# EasyEDA Pro project ProDoc_Custom Keyboard_2025-10-23_RV1.eprj, schematic Custom Keyboard

## Sheets
1 MCU: Board Name: Custom Keyboard; Create Date: 2025-08-29; Page Name: MCU; Project Name: Custom Keyboard; Schematic Name: Custom Keyboard; Update Date: 2025-09-15; Company: (C) FEDEVEL 2025; Drawn: Robert Feranec; Page Size: A3; Part Number: JLCPCB-002; Reviewed: EasyEDA; Version: V1.0
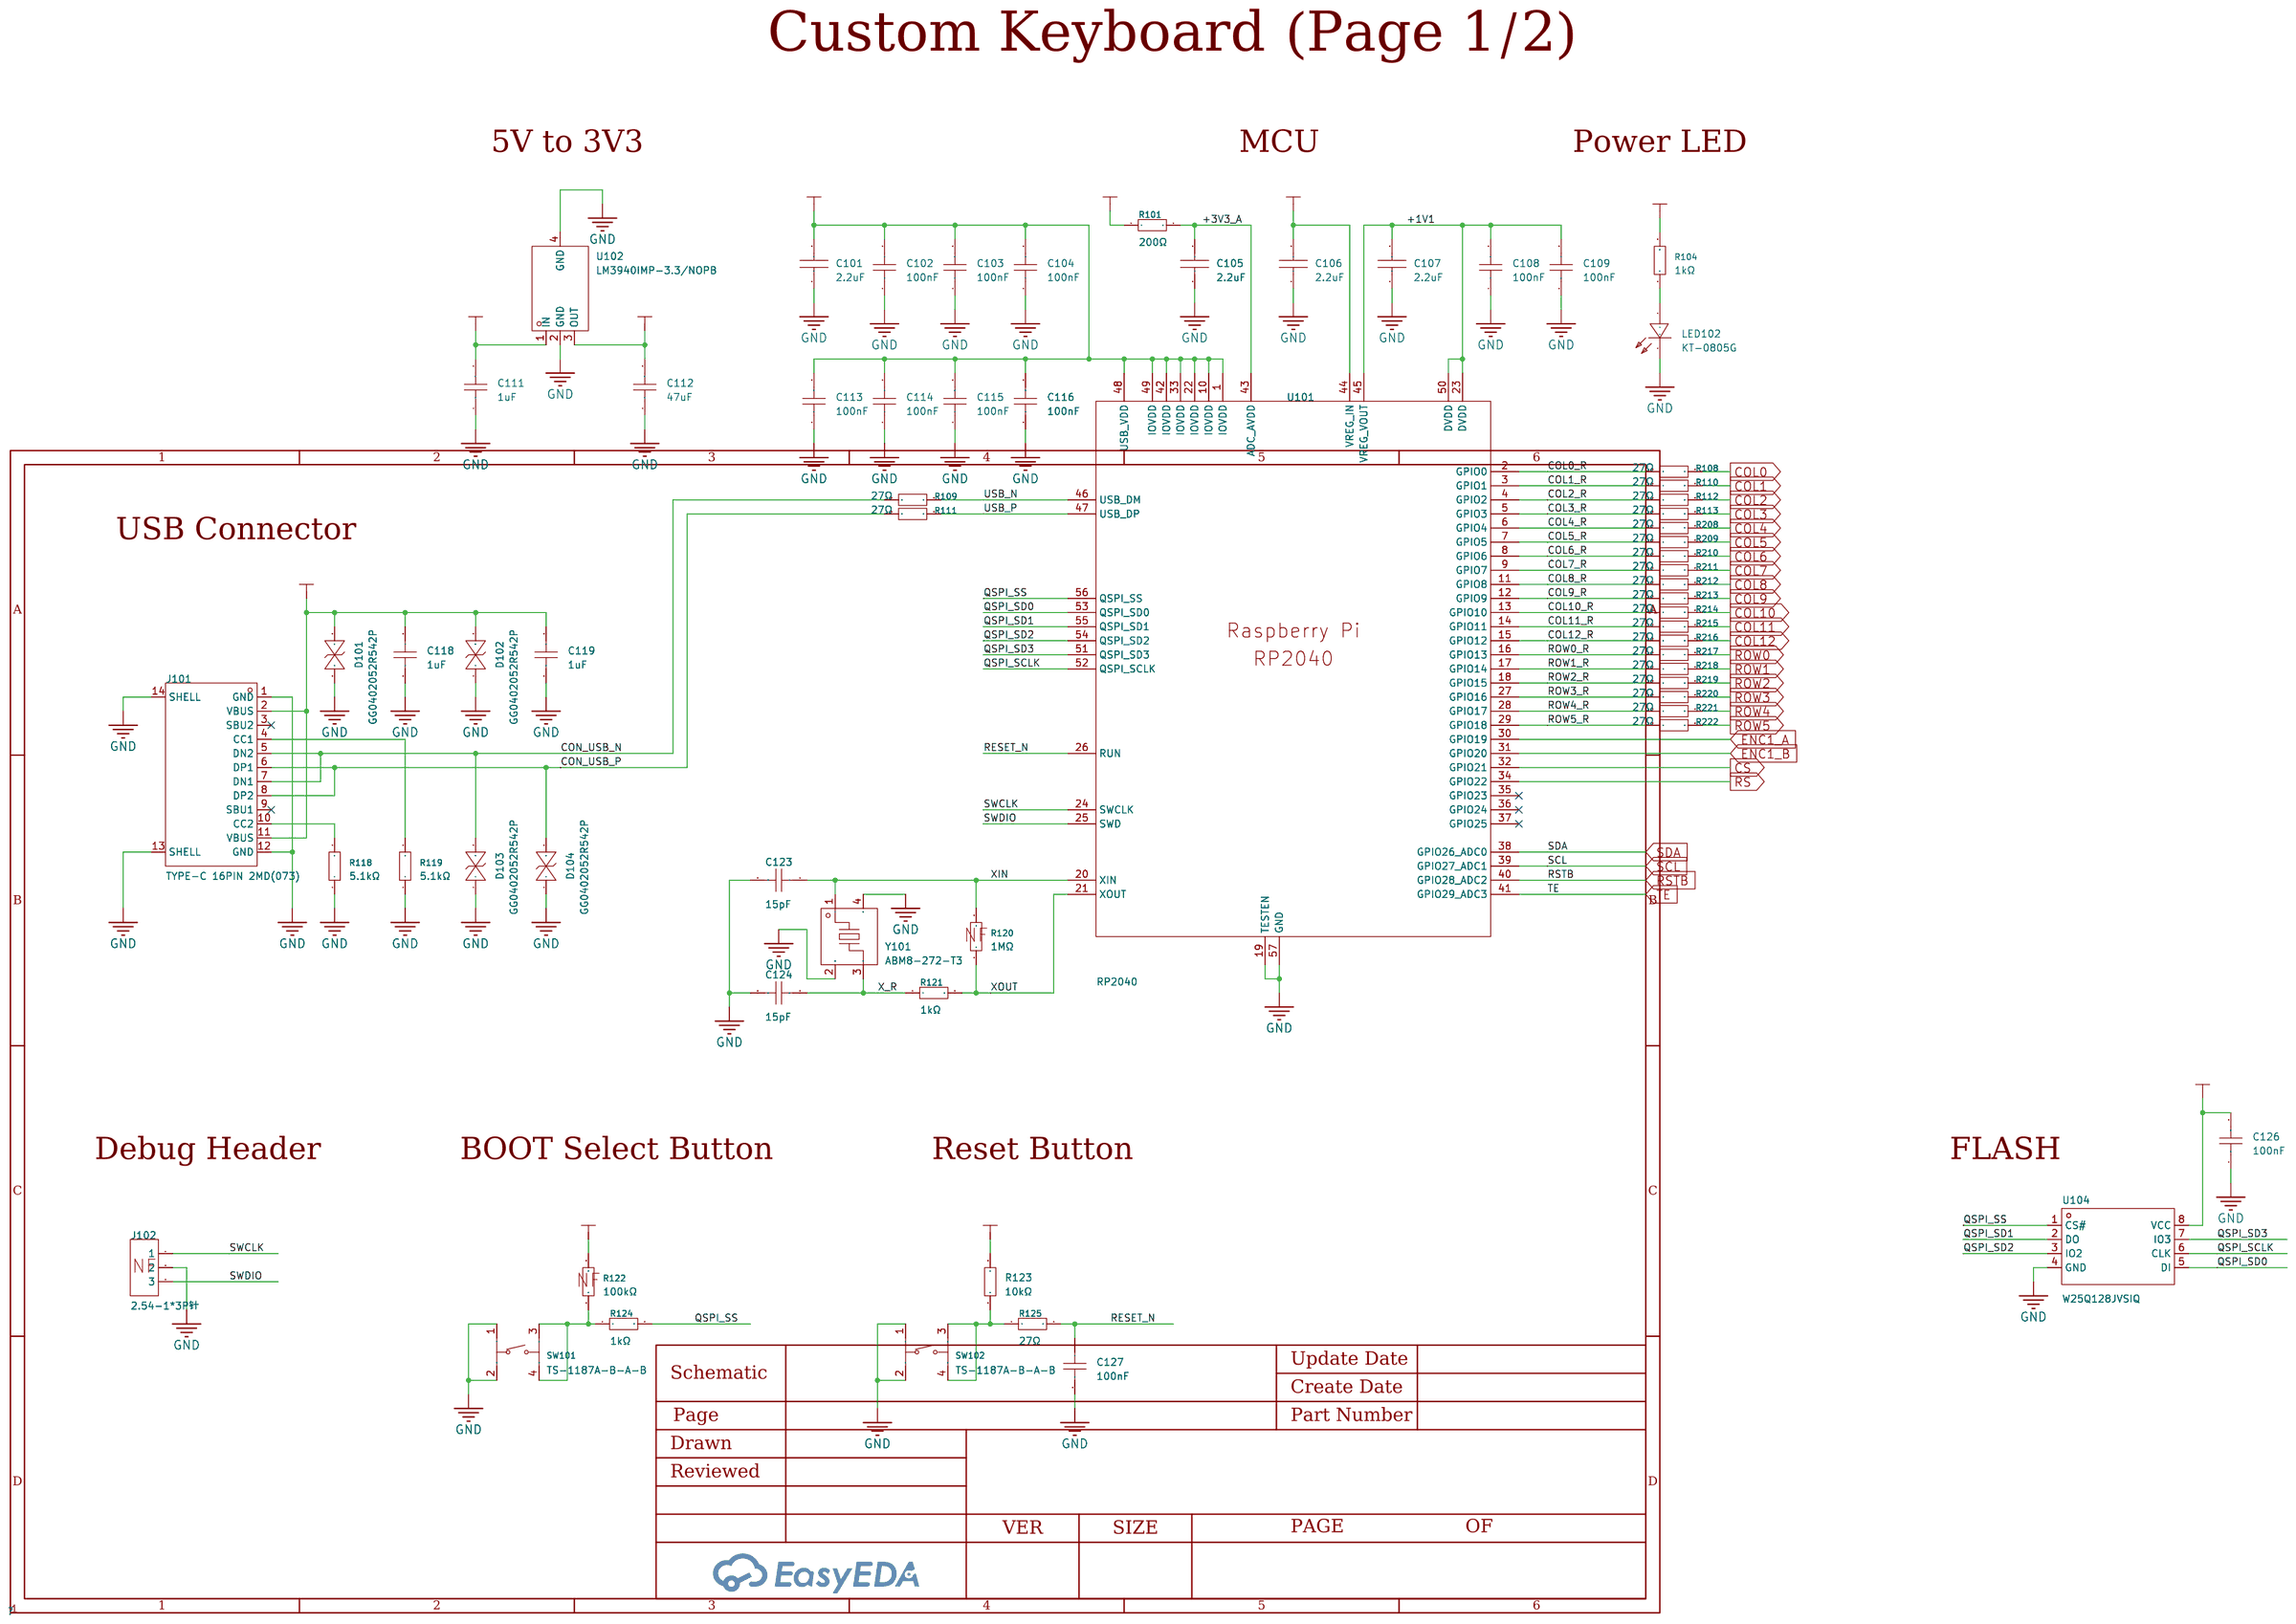
[diagram p0: MCU]
2 OTHER: Page Name: OTHER
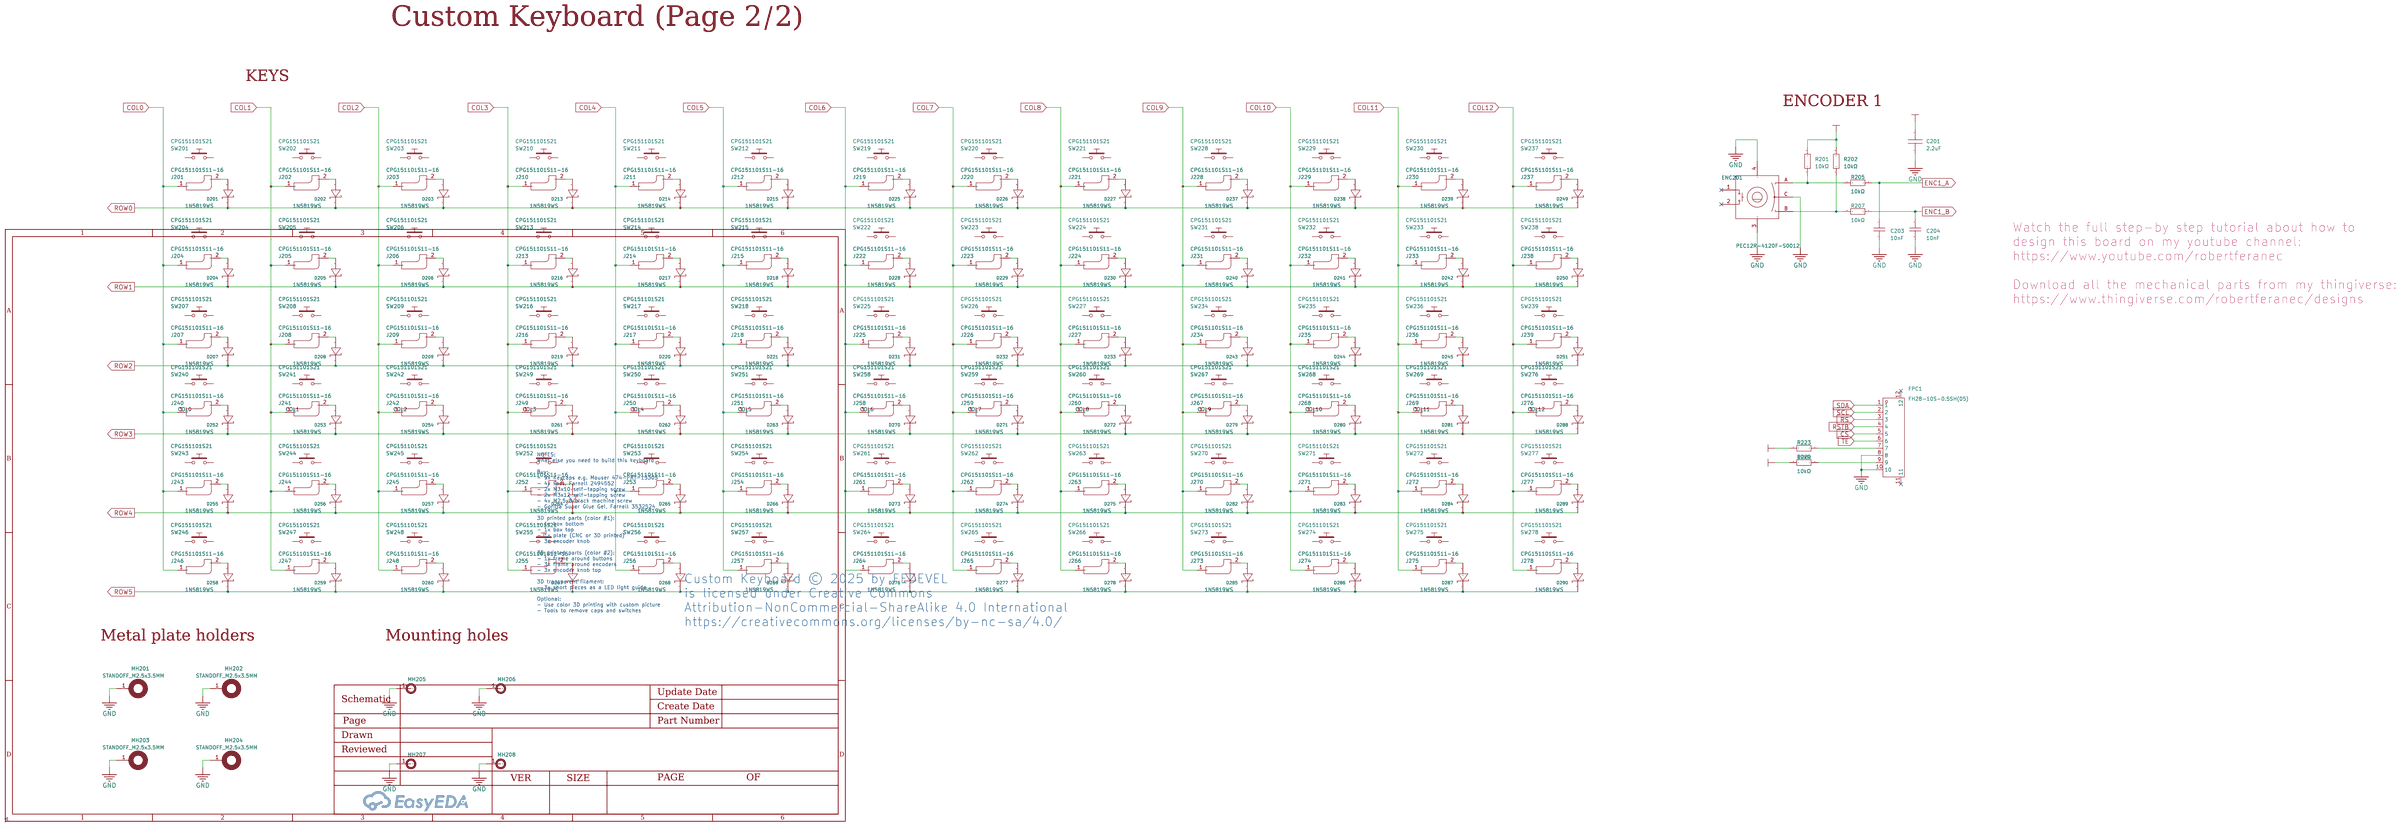
[diagram p1: OTHER]

## Parts
sheet MCU
C101  2.2uF  [C0402]
C102  100nF  [C0402]
C103  100nF  [C0402]
C104  100nF  [C0402]
C105  2.2uF  [C0402]
C106  2.2uF  [C0402]
C107  2.2uF  [C0402]
C108  100nF  [C0402]
C109  100nF  [C0402]
C111  1uF  [C0402]
C112  47uF  [C1206]
C113  100nF  [C0402]
C114  100nF  [C0402]
C115  100nF  [C0402]
C116  100nF  [C0402]
C118  1uF  [C0402]
C119  1uF  [C0402]
C123  15pF  [C0402]
C124  15pF  [C0402]
C126  100nF  [C0402]
C127  100nF  [C0402]
D101  GG0402052R542P  [D0402-BI]
D102  GG0402052R542P  [D0402-BI]
D103  GG0402052R542P  [D0402-BI]
D104  GG0402052R542P  [D0402-BI]
J101  TYPE-C 16PIN 2MD(073)  [USB-C-SMD_TYPE-C-6PIN-2MD-073]
J102  2.54-1*3P针  [HDR-TH_3P-P2.54-V-M-1]  (no BOM)
LED102  KT-0805G  [LED0805-R-RD]
R101  200Ω  [R0402]
R104  1kΩ  [R0402]
R108  27Ω  [R0402]
R109  27Ω  [R0402]
R110  27Ω  [R0402]
R111  27Ω  [R0402]
R112  27Ω  [R0402]
R113  27Ω  [R0402]
R118  5.1kΩ  [R0402]
R119  5.1kΩ  [R0402]
R120  1MΩ  [R0402]  (no BOM)
R121  1kΩ  [R0402]
R122  100kΩ  [R0402]  (no BOM)
R123  10kΩ  [R0402]
R124  1kΩ  [R0402]
R125  27Ω  [R0402]
R208  27Ω  [R0402]
R209  27Ω  [R0402]
R210  27Ω  [R0402]
R211  27Ω  [R0402]
R212  27Ω  [R0402]
R213  27Ω  [R0402]
R214  27Ω  [R0402]
R215  27Ω  [R0402]
R216  27Ω  [R0402]
R217  27Ω  [R0402]
R218  27Ω  [R0402]
R219  27Ω  [R0402]
R220  27Ω  [R0402]
R221  27Ω  [R0402]
R222  27Ω  [R0402]
SW101  TS-1187A-B-A-B  [SW-SMD_4P-L5.1-W5.1-P3.70-LS6.5-TL-2]
SW102  TS-1187A-B-A-B  [SW-SMD_4P-L5.1-W5.1-P3.70-LS6.5-TL-2]
U101  RP2040  [LQFN-56_L7.0-W7.0-P0.4-EP_1]
U102  LM3940IMP-3.3/NOPB  [SOT-223_L6.5-W3.5-P2.30-LS7.0-BR]
U104  W25Q128JVSIQ  [SOIC-8_L5.3-W5.3-P1.27-LS8.0-BL]
Y101  ABM8-272-T3  [CRYSTAL-SMD_4P-L3.2-W2.5-BL]
sheet OTHER
C201  2.2uF  [C0402]
C203  10nF  [C0402]
C204  10nF  [C0402]
D201  1N5819WS  [SOD-323_L1.8-W1.3-LS2.5-RD]
D202  1N5819WS  [SOD-323_L1.8-W1.3-LS2.5-RD]
D203  1N5819WS  [SOD-323_L1.8-W1.3-LS2.5-RD]
D204  1N5819WS  [SOD-323_L1.8-W1.3-LS2.5-RD]
D205  1N5819WS  [SOD-323_L1.8-W1.3-LS2.5-RD]
D206  1N5819WS  [SOD-323_L1.8-W1.3-LS2.5-RD]
D207  1N5819WS  [SOD-323_L1.8-W1.3-LS2.5-RD]
D208  1N5819WS  [SOD-323_L1.8-W1.3-LS2.5-RD]
D209  1N5819WS  [SOD-323_L1.8-W1.3-LS2.5-RD]
D213  1N5819WS  [SOD-323_L1.8-W1.3-LS2.5-RD]
D214  1N5819WS  [SOD-323_L1.8-W1.3-LS2.5-RD]
D215  1N5819WS  [SOD-323_L1.8-W1.3-LS2.5-RD]
D216  1N5819WS  [SOD-323_L1.8-W1.3-LS2.5-RD]
D217  1N5819WS  [SOD-323_L1.8-W1.3-LS2.5-RD]
D218  1N5819WS  [SOD-323_L1.8-W1.3-LS2.5-RD]
D219  1N5819WS  [SOD-323_L1.8-W1.3-LS2.5-RD]
D220  1N5819WS  [SOD-323_L1.8-W1.3-LS2.5-RD]
D221  1N5819WS  [SOD-323_L1.8-W1.3-LS2.5-RD]
D225  1N5819WS  [SOD-323_L1.8-W1.3-LS2.5-RD]
D226  1N5819WS  [SOD-323_L1.8-W1.3-LS2.5-RD]
D227  1N5819WS  [SOD-323_L1.8-W1.3-LS2.5-RD]
D228  1N5819WS  [SOD-323_L1.8-W1.3-LS2.5-RD]
D229  1N5819WS  [SOD-323_L1.8-W1.3-LS2.5-RD]
D230  1N5819WS  [SOD-323_L1.8-W1.3-LS2.5-RD]
D231  1N5819WS  [SOD-323_L1.8-W1.3-LS2.5-RD]
D232  1N5819WS  [SOD-323_L1.8-W1.3-LS2.5-RD]
D233  1N5819WS  [SOD-323_L1.8-W1.3-LS2.5-RD]
D237  1N5819WS  [SOD-323_L1.8-W1.3-LS2.5-RD]
D238  1N5819WS  [SOD-323_L1.8-W1.3-LS2.5-RD]
D239  1N5819WS  [SOD-323_L1.8-W1.3-LS2.5-RD]
D240  1N5819WS  [SOD-323_L1.8-W1.3-LS2.5-RD]
D241  1N5819WS  [SOD-323_L1.8-W1.3-LS2.5-RD]
D242  1N5819WS  [SOD-323_L1.8-W1.3-LS2.5-RD]
D243  1N5819WS  [SOD-323_L1.8-W1.3-LS2.5-RD]
D244  1N5819WS  [SOD-323_L1.8-W1.3-LS2.5-RD]
D245  1N5819WS  [SOD-323_L1.8-W1.3-LS2.5-RD]
D249  1N5819WS  [SOD-323_L1.8-W1.3-LS2.5-RD]
D250  1N5819WS  [SOD-323_L1.8-W1.3-LS2.5-RD]
D251  1N5819WS  [SOD-323_L1.8-W1.3-LS2.5-RD]
D252  1N5819WS  [SOD-323_L1.8-W1.3-LS2.5-RD]
D253  1N5819WS  [SOD-323_L1.8-W1.3-LS2.5-RD]
D254  1N5819WS  [SOD-323_L1.8-W1.3-LS2.5-RD]
D255  1N5819WS  [SOD-323_L1.8-W1.3-LS2.5-RD]
D256  1N5819WS  [SOD-323_L1.8-W1.3-LS2.5-RD]
D257  1N5819WS  [SOD-323_L1.8-W1.3-LS2.5-RD]
D258  1N5819WS  [SOD-323_L1.8-W1.3-LS2.5-RD]
D259  1N5819WS  [SOD-323_L1.8-W1.3-LS2.5-RD]
D260  1N5819WS  [SOD-323_L1.8-W1.3-LS2.5-RD]
D261  1N5819WS  [SOD-323_L1.8-W1.3-LS2.5-RD]
D262  1N5819WS  [SOD-323_L1.8-W1.3-LS2.5-RD]
D263  1N5819WS  [SOD-323_L1.8-W1.3-LS2.5-RD]
D264  1N5819WS  [SOD-323_L1.8-W1.3-LS2.5-RD]
D265  1N5819WS  [SOD-323_L1.8-W1.3-LS2.5-RD]
D266  1N5819WS  [SOD-323_L1.8-W1.3-LS2.5-RD]
D267  1N5819WS  [SOD-323_L1.8-W1.3-LS2.5-RD]
D268  1N5819WS  [SOD-323_L1.8-W1.3-LS2.5-RD]
D269  1N5819WS  [SOD-323_L1.8-W1.3-LS2.5-RD]
D270  1N5819WS  [SOD-323_L1.8-W1.3-LS2.5-RD]
D271  1N5819WS  [SOD-323_L1.8-W1.3-LS2.5-RD]
D272  1N5819WS  [SOD-323_L1.8-W1.3-LS2.5-RD]
D273  1N5819WS  [SOD-323_L1.8-W1.3-LS2.5-RD]
D274  1N5819WS  [SOD-323_L1.8-W1.3-LS2.5-RD]
D275  1N5819WS  [SOD-323_L1.8-W1.3-LS2.5-RD]
D276  1N5819WS  [SOD-323_L1.8-W1.3-LS2.5-RD]
D277  1N5819WS  [SOD-323_L1.8-W1.3-LS2.5-RD]
D278  1N5819WS  [SOD-323_L1.8-W1.3-LS2.5-RD]
D279  1N5819WS  [SOD-323_L1.8-W1.3-LS2.5-RD]
D280  1N5819WS  [SOD-323_L1.8-W1.3-LS2.5-RD]
D281  1N5819WS  [SOD-323_L1.8-W1.3-LS2.5-RD]
D282  1N5819WS  [SOD-323_L1.8-W1.3-LS2.5-RD]
D283  1N5819WS  [SOD-323_L1.8-W1.3-LS2.5-RD]
D284  1N5819WS  [SOD-323_L1.8-W1.3-LS2.5-RD]
D285  1N5819WS  [SOD-323_L1.8-W1.3-LS2.5-RD]
D286  1N5819WS  [SOD-323_L1.8-W1.3-LS2.5-RD]
D287  1N5819WS  [SOD-323_L1.8-W1.3-LS2.5-RD]
D288  1N5819WS  [SOD-323_L1.8-W1.3-LS2.5-RD]
D289  1N5819WS  [SOD-323_L1.8-W1.3-LS2.5-RD]
D290  1N5819WS  [SOD-323_L1.8-W1.3-LS2.5-RD]
ENC201  PEC12R-4120F-S0012  [SW-TH_PEC12R-4120F-S0012_1]
FPC1  FH28-10S-0.5SH(05)  [FFC-SMD_10P-P0.50_FH28-10S-0.5SH-05]
J201  CPG151101S11-16  [SMD_KEYBOARD-SW_1]
J202  CPG151101S11-16  [SMD_KEYBOARD-SW_1]
J203  CPG151101S11-16  [SMD_KEYBOARD-SW_1]
J204  CPG151101S11-16  [SMD_KEYBOARD-SW_1]
J205  CPG151101S11-16  [SMD_KEYBOARD-SW_1]
J206  CPG151101S11-16  [SMD_KEYBOARD-SW_1]
J207  CPG151101S11-16  [SMD_KEYBOARD-SW_1]
J208  CPG151101S11-16  [SMD_KEYBOARD-SW_1]
J209  CPG151101S11-16  [SMD_KEYBOARD-SW_1]
J210  CPG151101S11-16  [SMD_KEYBOARD-SW_1]
J211  CPG151101S11-16  [SMD_KEYBOARD-SW_1]
J212  CPG151101S11-16  [SMD_KEYBOARD-SW_1]
J213  CPG151101S11-16  [SMD_KEYBOARD-SW_1]
J214  CPG151101S11-16  [SMD_KEYBOARD-SW_1]
J215  CPG151101S11-16  [SMD_KEYBOARD-SW_1]
J216  CPG151101S11-16  [SMD_KEYBOARD-SW_1]
J217  CPG151101S11-16  [SMD_KEYBOARD-SW_1]
J218  CPG151101S11-16  [SMD_KEYBOARD-SW_1]
J219  CPG151101S11-16  [SMD_KEYBOARD-SW_1]
J220  CPG151101S11-16  [SMD_KEYBOARD-SW_1]
J221  CPG151101S11-16  [SMD_KEYBOARD-SW_1]
J222  CPG151101S11-16  [SMD_KEYBOARD-SW_1]
J223  CPG151101S11-16  [SMD_KEYBOARD-SW_1]
J224  CPG151101S11-16  [SMD_KEYBOARD-SW_1]
J225  CPG151101S11-16  [SMD_KEYBOARD-SW_1]
J226  CPG151101S11-16  [SMD_KEYBOARD-SW_1]
J227  CPG151101S11-16  [SMD_KEYBOARD-SW_1]
J228  CPG151101S11-16  [SMD_KEYBOARD-SW_1]
J229  CPG151101S11-16  [SMD_KEYBOARD-SW_1]
J230  CPG151101S11-16  [SMD_KEYBOARD-SW_1]
J231  CPG151101S11-16  [SMD_KEYBOARD-SW_1]
J232  CPG151101S11-16  [SMD_KEYBOARD-SW_1]
J233  CPG151101S11-16  [SMD_KEYBOARD-SW_1]
J234  CPG151101S11-16  [SMD_KEYBOARD-SW_1]
J235  CPG151101S11-16  [SMD_KEYBOARD-SW_1]
J236  CPG151101S11-16  [SMD_KEYBOARD-SW_1]
J237  CPG151101S11-16  [SMD_KEYBOARD-SW_1]
J238  CPG151101S11-16  [SMD_KEYBOARD-SW_1]
J239  CPG151101S11-16  [SMD_KEYBOARD-SW_1]
J240  CPG151101S11-16  [SMD_KEYBOARD-SW_1]
J241  CPG151101S11-16  [SMD_KEYBOARD-SW_1]
J242  CPG151101S11-16  [SMD_KEYBOARD-SW_1]
J243  CPG151101S11-16  [SMD_KEYBOARD-SW_1]
J244  CPG151101S11-16  [SMD_KEYBOARD-SW_1]
J245  CPG151101S11-16  [SMD_KEYBOARD-SW_1]
J246  CPG151101S11-16  [SMD_KEYBOARD-SW_1]
J247  CPG151101S11-16  [SMD_KEYBOARD-SW_1]
J248  CPG151101S11-16  [SMD_KEYBOARD-SW_1]
J249  CPG151101S11-16  [SMD_KEYBOARD-SW_1]
J250  CPG151101S11-16  [SMD_KEYBOARD-SW_1]
J251  CPG151101S11-16  [SMD_KEYBOARD-SW_1]
J252  CPG151101S11-16  [SMD_KEYBOARD-SW_1]
J253  CPG151101S11-16  [SMD_KEYBOARD-SW_1]
J254  CPG151101S11-16  [SMD_KEYBOARD-SW_1]
J255  CPG151101S11-16  [SMD_KEYBOARD-SW_1]
J256  CPG151101S11-16  [SMD_KEYBOARD-SW_1]
J257  CPG151101S11-16  [SMD_KEYBOARD-SW_1]
J258  CPG151101S11-16  [SMD_KEYBOARD-SW_1]
J259  CPG151101S11-16  [SMD_KEYBOARD-SW_1]
J260  CPG151101S11-16  [SMD_KEYBOARD-SW_1]
J261  CPG151101S11-16  [SMD_KEYBOARD-SW_1]
J262  CPG151101S11-16  [SMD_KEYBOARD-SW_1]
J263  CPG151101S11-16  [SMD_KEYBOARD-SW_1]
J264  CPG151101S11-16  [SMD_KEYBOARD-SW_1]
J265  CPG151101S11-16  [SMD_KEYBOARD-SW_1]
J266  CPG151101S11-16  [SMD_KEYBOARD-SW_1]
J267  CPG151101S11-16  [SMD_KEYBOARD-SW_1]
J268  CPG151101S11-16  [SMD_KEYBOARD-SW_1]
J269  CPG151101S11-16  [SMD_KEYBOARD-SW_1]
J270  CPG151101S11-16  [SMD_KEYBOARD-SW_1]
J271  CPG151101S11-16  [SMD_KEYBOARD-SW_1]
J272  CPG151101S11-16  [SMD_KEYBOARD-SW_1]
J273  CPG151101S11-16  [SMD_KEYBOARD-SW_1]
J274  CPG151101S11-16  [SMD_KEYBOARD-SW_1]
J275  CPG151101S11-16  [SMD_KEYBOARD-SW_1]
J276  CPG151101S11-16  [SMD_KEYBOARD-SW_1]
J277  CPG151101S11-16  [SMD_KEYBOARD-SW_1]
J278  CPG151101S11-16  [SMD_KEYBOARD-SW_1]
MH201  STANDOFF_M2.5x3.5MM  [STANDOFF_M2.5x3.5MM_RF_v1.0]
MH202  STANDOFF_M2.5x3.5MM  [STANDOFF_M2.5x3.5MM_RF_v1.0]
MH203  STANDOFF_M2.5x3.5MM  [STANDOFF_M2.5x3.5MM_RF_v1.0]
MH204  STANDOFF_M2.5x3.5MM  [STANDOFF_M2.5x3.5MM_RF_v1.0]
MH205  -  [MH_7.5X3.2MM_RF_v1.0]  (no BOM)
MH206  -  [MH_7.5X3.2MM_RF_v1.0]  (no BOM)
MH207  -  [MH_7.5X3.2MM_RF_v1.0]  (no BOM)
MH208  -  [MH_7.5X3.2MM_RF_v1.0]  (no BOM)
R201  10kΩ  [R0402]
R202  10kΩ  [R0402]
R205  10kΩ  [R0402]
R207  10kΩ  [R0402]
R223  10kΩ  [R0402]
R224  10kΩ  [R0402]
SW201  CPG151101S21  [KEY-TH_CPG1511F01S0X_1]
SW202  CPG151101S21  [KEY-TH_CPG1511F01S0X_1]
SW203  CPG151101S21  [KEY-TH_CPG1511F01S0X_1]
SW204  CPG151101S21  [KEY-TH_CPG1511F01S0X_1]
SW205  CPG151101S21  [KEY-TH_CPG1511F01S0X_1]
SW206  CPG151101S21  [KEY-TH_CPG1511F01S0X_1]
SW207  CPG151101S21  [KEY-TH_CPG1511F01S0X_1]
SW208  CPG151101S21  [KEY-TH_CPG1511F01S0X_1]
SW209  CPG151101S21  [KEY-TH_CPG1511F01S0X_1]
SW210  CPG151101S21  [KEY-TH_CPG1511F01S0X_1]
SW211  CPG151101S21  [KEY-TH_CPG1511F01S0X_1]
SW212  CPG151101S21  [KEY-TH_CPG1511F01S0X_1]
SW213  CPG151101S21  [KEY-TH_CPG1511F01S0X_1]
SW214  CPG151101S21  [KEY-TH_CPG1511F01S0X_1]
SW215  CPG151101S21  [KEY-TH_CPG1511F01S0X_1]
SW216  CPG151101S21  [KEY-TH_CPG1511F01S0X_1]
SW217  CPG151101S21  [KEY-TH_CPG1511F01S0X_1]
SW218  CPG151101S21  [KEY-TH_CPG1511F01S0X_1]
SW219  CPG151101S21  [KEY-TH_CPG1511F01S0X_1]
SW220  CPG151101S21  [KEY-TH_CPG1511F01S0X_1]
SW221  CPG151101S21  [KEY-TH_CPG1511F01S0X_1]
SW222  CPG151101S21  [KEY-TH_CPG1511F01S0X_1]
SW223  CPG151101S21  [KEY-TH_CPG1511F01S0X_1]
SW224  CPG151101S21  [KEY-TH_CPG1511F01S0X_1]
SW225  CPG151101S21  [KEY-TH_CPG1511F01S0X_1]
SW226  CPG151101S21  [KEY-TH_CPG1511F01S0X_1]
SW227  CPG151101S21  [KEY-TH_CPG1511F01S0X_1]
SW228  CPG151101S21  [KEY-TH_CPG1511F01S0X_1]
SW229  CPG151101S21  [KEY-TH_CPG1511F01S0X_1]
SW230  CPG151101S21  [KEY-TH_CPG1511F01S0X_1]
SW231  CPG151101S21  [KEY-TH_CPG1511F01S0X_1]
SW232  CPG151101S21  [KEY-TH_CPG1511F01S0X_1]
SW233  CPG151101S21  [KEY-TH_CPG1511F01S0X_1]
SW234  CPG151101S21  [KEY-TH_CPG1511F01S0X_1]
SW235  CPG151101S21  [KEY-TH_CPG1511F01S0X_1]
SW236  CPG151101S21  [KEY-TH_CPG1511F01S0X_1]
SW237  CPG151101S21  [KEY-TH_CPG1511F01S0X_1]
SW238  CPG151101S21  [KEY-TH_CPG1511F01S0X_1]
SW239  CPG151101S21  [KEY-TH_CPG1511F01S0X_1]
SW240  CPG151101S21  [KEY-TH_CPG1511F01S0X_1]
SW241  CPG151101S21  [KEY-TH_CPG1511F01S0X_1]
SW242  CPG151101S21  [KEY-TH_CPG1511F01S0X_1]
SW243  CPG151101S21  [KEY-TH_CPG1511F01S0X_1]
SW244  CPG151101S21  [KEY-TH_CPG1511F01S0X_1]
SW245  CPG151101S21  [KEY-TH_CPG1511F01S0X_1]
SW246  CPG151101S21  [KEY-TH_CPG1511F01S0X_1]
SW247  CPG151101S21  [KEY-TH_CPG1511F01S0X_1]
SW248  CPG151101S21  [KEY-TH_CPG1511F01S0X_1]
SW249  CPG151101S21  [KEY-TH_CPG1511F01S0X_1]
SW250  CPG151101S21  [KEY-TH_CPG1511F01S0X_1]
SW251  CPG151101S21  [KEY-TH_CPG1511F01S0X_1]
SW252  CPG151101S21  [KEY-TH_CPG1511F01S0X_1]
SW253  CPG151101S21  [KEY-TH_CPG1511F01S0X_1]
SW254  CPG151101S21  [KEY-TH_CPG1511F01S0X_1]
SW255  CPG151101S21  [KEY-TH_CPG1511F01S0X_1]
SW256  CPG151101S21  [KEY-TH_CPG1511F01S0X_1]
SW257  CPG151101S21  [KEY-TH_CPG1511F01S0X_1]
SW258  CPG151101S21  [KEY-TH_CPG1511F01S0X_1]
SW259  CPG151101S21  [KEY-TH_CPG1511F01S0X_1]
SW260  CPG151101S21  [KEY-TH_CPG1511F01S0X_1]
SW261  CPG151101S21  [KEY-TH_CPG1511F01S0X_1]
SW262  CPG151101S21  [KEY-TH_CPG1511F01S0X_1]
SW263  CPG151101S21  [KEY-TH_CPG1511F01S0X_1]
SW264  CPG151101S21  [KEY-TH_CPG1511F01S0X_1]
SW265  CPG151101S21  [KEY-TH_CPG1511F01S0X_1]
SW266  CPG151101S21  [KEY-TH_CPG1511F01S0X_1]
SW267  CPG151101S21  [KEY-TH_CPG1511F01S0X_1]
SW268  CPG151101S21  [KEY-TH_CPG1511F01S0X_1]
SW269  CPG151101S21  [KEY-TH_CPG1511F01S0X_1]
SW270  CPG151101S21  [KEY-TH_CPG1511F01S0X_1]
SW271  CPG151101S21  [KEY-TH_CPG1511F01S0X_1]
SW272  CPG151101S21  [KEY-TH_CPG1511F01S0X_1]
SW273  CPG151101S21  [KEY-TH_CPG1511F01S0X_1]
SW274  CPG151101S21  [KEY-TH_CPG1511F01S0X_1]
SW275  CPG151101S21  [KEY-TH_CPG1511F01S0X_1]
SW276  CPG151101S21  [KEY-TH_CPG1511F01S0X_1]
SW277  CPG151101S21  [KEY-TH_CPG1511F01S0X_1]
SW278  CPG151101S21  [KEY-TH_CPG1511F01S0X_1]

## Library data of the parts
C101 C105-C107 C201 = CL05A225MQ5NSNC: Capacitance: Tolerance:±20% Tolerance:±20% Voltage Rated: Temperature Coefficient:; LCSC Part Name: 2.2uF ±20% 6.3V; Supplier Part: C12530; Manufacturer: SAMSUNG(三星); Supplier Footprint: 0402; JLCPCB Part Class: Basic Part; Datasheet: https://atta.szlcsc.com/upload/public/pdf/source/20160218/1457707763339.pdf; Supplier: LCSC; Tolerance: ±20%
C102-C104 C108 C109 C113-C116 C126 C127 = CL05B104KO5NNNC: Capacitance: Tolerance:±10% Tolerance:±10% Voltage Rated: Temperature Coefficient:; LCSC Part Name: 100nF ±10% 16V; Supplier Part: C1525; Manufacturer: SAMSUNG(三星); Supplier Footprint: 0402; JLCPCB Part Class: Basic Part; Datasheet: https://atta.szlcsc.com/upload/public/pdf/source/20160218/1457707763339.pdf; Supplier: LCSC; Tolerance: ±10%
C111 C118 C119 = CL05A105KA5NQNC: Capacitance: Tolerance:±10% Tolerance:±10% Voltage Rated: Temperature Coefficient:; LCSC Part Name: 1uF ±10% 25V; Supplier Part: C52923; Manufacturer: SAMSUNG(三星); Supplier Footprint: 0402; JLCPCB Part Class: Basic Part; Datasheet: https://atta.szlcsc.com/upload/public/pdf/source/20160218/1457707763339.pdf; Supplier: LCSC; Tolerance: ±10%
C112 = CL31A476MPHNNNE: Capacitance: Tolerance:±20% Tolerance:±20% Voltage Rated: Temperature Coefficient:; LCSC Part Name: 47uF ±20% 10V; Supplier Part: C96123; Manufacturer: SAMSUNG(三星); Supplier Footprint: 1206; JLCPCB Part Class: Basic Part; Datasheet: https://atta.szlcsc.com/upload/public/pdf/source/20160218/1457707763339.pdf; Supplier: LCSC; Tolerance: ±20%
C123 C124 = CL05C150JB5NNNC: Capacitance: Tolerance:±5% Tolerance:±5% Voltage Rated: Temperature Coefficient:; LCSC Part Name: 15pF ±5% 50V; Supplier Part: C86285; Manufacturer: SAMSUNG(三星); Supplier Footprint: 0402; JLCPCB Part Class: Extended Part; Datasheet: https://atta.szlcsc.com/upload/public/pdf/source/20160218/1457707763339.pdf; Supplier: LCSC; Tolerance: ±5%
D101-D104 = GG0402052R542P: Reverse Stand-Off Voltage (Vrwm):5V Maximum Clamping Voltage:15.5V Peak Pulse Current (Ipp)@10/1000us:3A@8/20us Peak Pulse Power Dissipation (Ppp)@10/1000us:46W Breakdown Voltage:5.5V Type:TVS; LCSC Part Name: TVS 5V截止 3A峰值脉冲; Supplier Part: C1973257; Manufacturer: Kyocera AVX; Supplier Footprint: 0402; JLCPCB Part Class: Extended Part; Datasheet: https://atta.szlcsc.com/upload/public/pdf/source/20230915/02C5CA4E262376923D9117899A14A9C6.pdf; Supplier: LCSC; Reverse Stand-Off Voltage (Vrwm): 5V; Maximum Clamping Voltage: 15.5V; Peak Pulse Current (Ipp)@10/1000us: 3A@8/20us; Peak Pulse Power Dissipation (Ppp)@10/1000us: 46W; Breakdown Voltage: 5.5V; Type: TVS
J101 = TYPE-C 16PIN 2MD(073): Connector Type:Type-C Standard:USB 3.1 Gender:Female Mounting Style:Horizontal attachment Number of Contacts:16P Number of Ports:1 Current Rating - Power (Max):5A Operating Temperature Range:-25℃~+85℃ Operating Temperature Range:-25℃~+85℃ Rated Voltage (M; LCSC Part Name: Type-C 母 卧贴; Supplier Part: C2765186; Manufacturer: SHOU HAN(首韩); Supplier Footprint: SMD; JLCPCB Part Class: Extended Part; Datasheet: https://atta.szlcsc.com/upload/public/pdf/source/20211123/39B17C16241EAC15C5E277BDA434118E.pdf; Supplier: LCSC; Connector Type: Type-C; Standard: USB 3.1; Gender: Female; Mounting Style: Horizontal attachment; Number of Contacts: 16P; Number of Ports: 1; Current Rating - Power (Max): 5A; Operating Temperature Range: -25℃~+85℃; Rated Voltage (Max): 5V; Connect-Disconnect Life: 5000 Cuts; Core Colour: Black
J102 = 2.54-1*3P针: Pin Structure:1x3P Pitch:2.54mm Row Spacing:- Circluar Pins/Square Pins:Square Pins Mounting Type:Straight Number of Rows:Plugin Number of Pins:3P Current Rating (Max):3A Voltage Rating (Max):- Length of Mating Pin:- Insulation Height:- Length of End Conn; LCSC Part Name: 间距:2.54mm 1x3P 直插 方针; Supplier Part: C49257; Manufacturer: BOOMELE(博穆精密); Supplier Footprint: 插件,P=2.54mm; JLCPCB Part Class: Extended Part; Datasheet: https://atta.szlcsc.com/upload/public/pdf/source/20221018/3E9408392E35E6F57A28985E5F7BF5C9.pdf; Supplier: LCSC; Pin Structure: 1x3P; Pitch: 2.54mm; Circluar Pins/Square Pins: Square Pins; Mounting Type: Straight; Number of Rows: Plugin; Number of Pins: 3P; Current Rating (Max): 3A; Operating Temperature Range: -40℃~+105℃; Color: Black
LED102 = KT-0805G: Lamp Holder Type:- Emitted Color:Emerald Forward Voltage (VF):- Forward Voltage (VF):- Power Dissipation:- Forward Current:- Dominant Wavelength:- Dominant Wavelength:- Peak Wavelength:- Diode Configuration:- Lens Color:- Color Temperature:- Color Tempera; LCSC Part Name: 0805 翠绿 高亮; Supplier Part: C2297; Manufacturer: KENTO; Supplier Footprint: 0805; JLCPCB Part Class: Basic Part; Datasheet: https://atta.szlcsc.com/upload/public/pdf/source/20170209/1486607340485.pdf; Supplier: LCSC; Emitted Color: Emerald
R101 = 0402WGF2000TCE: Type:Thick Film Resistors Resistance: Tolerance:±1% Tolerance:±1% Power(Watts): Overload Voltage (Max): Temperature Coefficient:±100ppm/℃ Temperature Coefficient:±100ppm/℃ Operating Temperature Range:-55℃~+155℃ Operating Temperature Range:-55℃~+155℃; LCSC Part Name: 200Ω ±1% 62.5mW 厚膜电阻; Supplier Part: C25087; Manufacturer: UNI-ROYAL(厚声); Supplier Footprint: 0402; JLCPCB Part Class: Basic Part; Datasheet: https://atta.szlcsc.com/upload/public/pdf/source/20200306/C422600_1E6D84923E4A46A82E41ADD87F860B5C.pdf; Supplier: LCSC; Type: Thick Film Resistors; Tolerance: ±1%; Temperature Coefficient: ±100ppm/℃; Operating Temperature Range: -55℃~+155℃
R104 R121 R124 = 0402WGF1001TCE: Type:Thick Film Resistors Resistance:1kΩ Tolerance:±1% Tolerance:±1% Power(Watts): Overload Voltage (Max): Temperature Coefficient:±100ppm/℃ Temperature Coefficient:±100ppm/℃ Operating Temperature Range:-55℃~+155℃ Operating Temperature Range:-55℃~+155℃; LCSC Part Name: 1kΩ ±1% 62.5mW 厚膜电阻; Supplier Part: C11702; Manufacturer: UNI-ROYAL(厚声); Supplier Footprint: 0402; JLCPCB Part Class: Basic Part; Datasheet: https://atta.szlcsc.com/upload/public/pdf/source/20200306/C422600_1E6D84923E4A46A82E41ADD87F860B5C.pdf; Supplier: LCSC; Type: Thick Film Resistors; Tolerance: ±1%; Temperature Coefficient: ±100ppm/℃; Operating Temperature Range: -55℃~+155℃
R108-R113 R125 R208-R222 = 0402WGF270JTCE: Type:Thick Film Resistors Resistance:27Ω Tolerance:±1% Tolerance:±1% Power(Watts): Overload Voltage (Max): Temperature Coefficient:±100ppm/℃ Temperature Coefficient:±100ppm/℃ Operating Temperature Range:-55℃~+155℃ Operating Temperature Range:-55℃~+155℃; LCSC Part Name: 27Ω ±1% 62.5mW 厚膜电阻; Supplier Part: C25100; Manufacturer: UNI-ROYAL(厚声); Supplier Footprint: 0402; JLCPCB Part Class: Extended Part; Datasheet: https://atta.szlcsc.com/upload/public/pdf/source/20200306/C422600_1E6D84923E4A46A82E41ADD87F860B5C.pdf; Supplier: LCSC; Type: Thick Film Resistors; Tolerance: ±1%; Temperature Coefficient: ±100ppm/℃; Operating Temperature Range: -55℃~+155℃
R118 R119 = 0402WGF5101TCE: Type:Thick Film Resistors Resistance:5.1kΩ Tolerance:±1% Tolerance:±1% Power(Watts): Overload Voltage (Max): Temperature Coefficient:±100ppm/℃ Temperature Coefficient:±100ppm/℃ Operating Temperature Range:-55℃~+155℃ Operating Temperature Range:-55℃~+155℃; LCSC Part Name: 5.1kΩ ±1% 62.5mW 厚膜电阻; Supplier Part: C25905; Manufacturer: UNI-ROYAL(厚声); Supplier Footprint: 0402; JLCPCB Part Class: Basic Part; Datasheet: https://atta.szlcsc.com/upload/public/pdf/source/20200306/C422600_1E6D84923E4A46A82E41ADD87F860B5C.pdf; Supplier: LCSC; Type: Thick Film Resistors; Tolerance: ±1%; Temperature Coefficient: ±100ppm/℃; Operating Temperature Range: -55℃~+155℃
R120 = 0402WGF1004TCE: Type:Thick Film Resistors Resistance:1MΩ Tolerance:±1% Tolerance:±1% Power(Watts): Overload Voltage (Max): Temperature Coefficient:±100ppm/℃ Temperature Coefficient:±100ppm/℃ Operating Temperature Range:-55℃~+155℃ Operating Temperature Range:-55℃~+155℃; LCSC Part Name: 1MΩ ±1% 62.5mW 厚膜电阻; Supplier Part: C26083; Manufacturer: UNI-ROYAL(厚声); Supplier Footprint: 0402; JLCPCB Part Class: Basic Part; Datasheet: https://atta.szlcsc.com/upload/public/pdf/source/20200306/C422600_1E6D84923E4A46A82E41ADD87F860B5C.pdf; Supplier: LCSC; Type: Thick Film Resistors; Tolerance: ±1%; Temperature Coefficient: ±100ppm/℃; Operating Temperature Range: -55℃~+155℃
R122 = 0402WGF1003TCE: Type:Thick Film Resistors Resistance:100kΩ Tolerance:±1% Tolerance:±1% Power(Watts): Overload Voltage (Max): Temperature Coefficient:±100ppm/℃ Temperature Coefficient:±100ppm/℃ Operating Temperature Range:-55℃~+155℃ Operating Temperature Range:-55℃~+155℃; LCSC Part Name: 100kΩ ±1% 62.5mW 厚膜电阻; Supplier Part: C25741; Manufacturer: UNI-ROYAL(厚声); Supplier Footprint: 0402; JLCPCB Part Class: Basic Part; Datasheet: https://atta.szlcsc.com/upload/public/pdf/source/20200306/C422600_1E6D84923E4A46A82E41ADD87F860B5C.pdf; Supplier: LCSC; Type: Thick Film Resistors; Tolerance: ±1%; Temperature Coefficient: ±100ppm/℃; Operating Temperature Range: -55℃~+155℃
R123 R201 R202 R205 R207 R223 R224 = 0402WGF1002TCE: Type:Thick Film Resistors Resistance:10kΩ Tolerance:±1% Tolerance:±1% Power(Watts): Overload Voltage (Max): Temperature Coefficient:±100ppm/℃ Temperature Coefficient:±100ppm/℃ Operating Temperature Range:-55℃~+155℃ Operating Temperature Range:-55℃~+155℃; LCSC Part Name: 10kΩ ±1% 62.5mW 厚膜电阻; Supplier Part: C25744; Manufacturer: UNI-ROYAL(厚声); Supplier Footprint: 0402; JLCPCB Part Class: Basic Part; Datasheet: https://atta.szlcsc.com/upload/public/pdf/source/20200306/C422600_1E6D84923E4A46A82E41ADD87F860B5C.pdf; Supplier: LCSC; Type: Thick Film Resistors; Tolerance: ±1%; Temperature Coefficient: ±100ppm/℃; Operating Temperature Range: -55℃~+155℃
SW101 SW102 = TS-1187A-B-A-B: Circuit:SPST Actuator Style:Round Button Operating Force:160gf Mounting Style:Brick nogging Switch Length:5.1mm Switch Width:5.1mm Switch Height:1.5mm Strike Gundam:不带 Contact Current:50mA Voltage Rating (DC):12V Insulation Resistance:- Actuator/Cap Color; LCSC Part Name: 5.1*5.1*1.5mm 立贴 轻触开关; Supplier Part: C318884; Manufacturer: XKB Connectivity(中国星坤); Supplier Footprint: SMD; JLCPCB Part Class: Basic Part; Datasheet: https://atta.szlcsc.com/upload/public/pdf/source/20200227/C318890_053E50208A88A7BA1965D8746000774E.pdf; Supplier: LCSC; Circuit: SPST; Actuator Style: Round Button; Operating Force: 160gf; Mounting Style: Brick nogging; Switch Length: 5.1mm; Switch Width: 5.1mm; Switch Height: 1.5mm; Strike Gundam: 不带; Contact Current: 50mA; Voltage Rating (DC): 12V; Actuator/Cap Color: 金色; With Lamp: No; Mechanical Life: 10万次; Operating Temperature: -30℃~+85℃
U101 = RP2040_C2040_RF_v1.0: CPU Core:- RAM Size:264KB GPIO Ports Number:30 Operating Voltage Range:- Operating Voltage Range:- CPU Maximum Speed:133MHz Program Memory Type:- Operating Temperature Range:- Operating Temperature Range:- ADC (Bit):12bit DAC (Bit):- PWM (Bit):- 8Bit Time; LCSC Part Name: RP2040（RP2B2）; Supplier Part: C2040; Manufacturer: Raspberry Pi(树莓派); Supplier Footprint: LQFN-56(7x7); Datasheet: https://atta.szlcsc.com/upload/public/pdf/source/20210621/C2040_96F425825606B7957D87DD32E2512CA9.pdf; Supplier: LCSC; RAM Size: 264KB; GPIO Ports Number: 30; CPU Maximum Speed: 133MHz; ADC (Bit): 12bit; UART/USART: 2; I2C: 2; SPI: 2; Universal Serial Bus: 有; Peripheral/Function: DMA；PWM; Direct Memory Access: 有
U102 = LM3940IMP-3.3/NOPB: Output Type:Fixed Maximum Input Voltage:7.5V Output Voltage:3.3V Output Voltage:3.3V Output Current:1A Power Supply Rejection Ratio (PSRR):- Dropout Voltage:200mV@(100mA) Feature:防静电保护；Short-Circuit  Protection；低ESR；Thermal Protection(TSD)；Overcurrent Pro; LCSC Part Name: 用于 5V 至 3.3V 电压转换的 1A 低压降稳压器; Supplier Part: C140319; Manufacturer: TI(德州仪器); Supplier Footprint: SOT-223; JLCPCB Part Class: Extended Part; Datasheet: https://www.ti.com/cn/lit/gpn/lm3940; Supplier: LCSC; Output Type: Fixed; Maximum Input Voltage: 7.5V; Output Voltage: 3.3V; Output Current: 1A; Dropout Voltage: 200mV@(100mA); Feature: 防静电保护；Short-Circuit  Protection；低ESR；Thermal Protection(TSD)；Overcurrent Protection(OCP)；带使能; Operating Temperature: -40℃~+125℃; Output Polarity: Positive electrode; Number of Outputs: 1
U104 = W25Q128JVSIQ: Interface Type:- Memory Size:128Mbit Clock Frequency (fc):- Supply Voltage:- Supply Voltage:- Page Programming Time (Tpp):- Block Erase Time (tBE):- Data Retention - TDR (Year):- Operating Temperature:- Operating Temperature:-; LCSC Part Name: W25Q128JVSIQ 编带; Supplier Part: C97521; Manufacturer: WINBOND(华邦); Supplier Footprint: SOIC-8-208mil; JLCPCB Part Class: Basic Part; Datasheet: https://atta.szlcsc.com/upload/public/pdf/source/20170316/1489627409956.pdf; Supplier: LCSC; Memory Size: 128Mbit
Y101 = ABM8-272-T3_C20625731: Supplier Part: C20625731; Manufacturer: ABRACON; Supplier Footprint: SMD3225-4P; JLCPCB Part Class: Extended Part; Datasheet: https://atta.szlcsc.com/upload/public/pdf/source/20240227/A8BE43F636D80F75C9AF5C59EDF21E9A.pdf; Supplier: LCSC
C203 C204 = CL05B103KB5NNNC: Capacitance: Tolerance:±10% Tolerance:±10% Voltage Rated: Temperature Coefficient:; LCSC Part Name: 10nF ±10% 50V; Supplier Part: C15195; Manufacturer: SAMSUNG(三星); Supplier Footprint: 0402; JLCPCB Part Class: Basic Part; Datasheet: https://atta.szlcsc.com/upload/public/pdf/source/20160218/1457707763339.pdf; Supplier: LCSC; Tolerance: ±10%
D201-D209 D213-D221 D225-D233 D237-D245 D249-D290 = 1N5819WS_C191023: Forward Voltage (Vf@If):600mV@1A Reverse Voltage (Vr):40V Average Rectified Current (Io):1A; LCSC Part Name: 电压:40V 电流:1A; Supplier Part: C191023; Manufacturer: Hottech(合科泰); Supplier Footprint: SOD-323; JLCPCB Part Class: Basic Part; Datasheet: https://atta.szlcsc.com/upload/public/pdf/source/20220428/3CB86FD8D28D653594B4E35F9D5AEFD9.pdf; Supplier: LCSC; Forward Voltage (Vf@If): 600mV@1A; Reverse Voltage (Vr): 40V; Average Rectified Current (Io): 1A
ENC201 = PEC12R-4120F-S0012_RF_v1.0: Supplier Part: C143801; Manufacturer: BOURNS; Supplier Footprint: 插件; Datasheet: https://atta.szlcsc.com/upload/public/pdf/source/20220425/FDFEFF279D64F139C3201B9534523AD5.pdf; Supplier: LCSC
FPC1 = FH28-10S-0.5SH(05): Locking Feature:- Contact Type:Bottom Contact Number of Contacts:10P Pitch:0.5mm Mounting Type:Surface Mount, Right Angle FFC, FCB Thickness:0.3mm FFC, FCB Thickness:0.3mm Height Above Board:2.55mm Contact Material:Phosphor Bronze Contact Plating:Gold Ope; LCSC Part Name: 间距:0.5mm P数:10P 下接; Supplier Part: C598018; Manufacturer: HRS(广濑); Supplier Footprint: SMD,P=0.5mm,卧贴; JLCPCB Part Class: Extended Part; Datasheet: https://item.szlcsc.com/datasheet/FH28-10S-0.5SH(05)/626634.html; Supplier: LCSC; Contact Type: Bottom Contact; Number of Contacts: 10P; Pitch: 0.5mm; Mounting Type: Surface Mount, Right Angle; FFC, FCB Thickness: 0.3mm; Height Above Board: 2.55mm; Contact Material: Phosphor Bronze; Contact Plating: Gold; Operating Temperature: -40℃~+105℃
J201-J278 = CPG151101S11-16_RF_v1.0: Axis Type:- Operating Voltage:2V~12V Operating Voltage:2V~12V Pin:- Mechanical Life:- Operation Force:- Conduction Travel:- Total Travel:- Operating Temperature:- Operating Temperature:-; Supplier Part: C5156480; Manufacturer: Kailh(凯华); Datasheet: https://atta.szlcsc.com/upload/public/pdf/source/20220829/33DFC1A320A078D20879F2B21562B513.pdf; Supplier: LCSC; Operating Voltage: 2V~12V
MH201-MH204 = 9774035151R_RF_v1.0: Standoff, Steel, M2.5, Hex Female-Female, 3.5 mm, 4.9 mm, WA-SMSI Series; Manufacturer: WURTH ELEKTRONIK; Supplier: FARNELL; Supplier Part: 3757968; Part Number: 9774035151R
MH205-MH208 = MH_7.5X3.2MM_RF_v1.0
SW201-SW278 = CPG151101S21 RF v1.0: Axis Type:Red axis Operating Voltage:2V~12V Operating Voltage:2V~12V Pin:2 Mechanical Life:70 Million Times Operation Force:50gf@±10gf Conduction Travel:1.9mm Total Travel:4mm Operating Temperature:-10℃~+70℃ Operating Temperature:-10℃~+70℃; LCSC Part Name: KT 红轴; Supplier Part: C404351; Manufacturer: Kailh(凯华); Supplier Footprint: 插件; Datasheet: https://atta.szlcsc.com/upload/public/pdf/source/20190830/C404351_7D6B52E742ECF8B3BC352AD1FDA65BD7.pdf; Supplier: LCSC; Axis Type: Red axis; Operating Voltage: 2V~12V; Pin: 2; Mechanical Life: 70 Million Times; Operation Force: 50gf@±10gf; Conduction Travel: 1.9mm; Total Travel: 4mm; Operating Temperature: -10℃~+70℃

## Nets
+1V1: C107.2 C108.2 C109.2 U101.23(DVDD) U101.45(VREG_VOUT) U101.50(DVDD)
+3V3: C101.2 C102.2 C103.2 C104.2 C106.2 C112.2 C113.2 C114.2 C115.2 C116.2 C126.2 C201.2 R101.1 R104.2 R122.2 R123.2 R201.2 R202.2 R223.2 R224.2 U101.1(IOVDD) U101.10(IOVDD) U101.22(IOVDD) U101.33(IOVDD) U101.42(IOVDD) U101.44(VREG_IN) U101.48(USB_VDD) U101.49(IOVDD) U102.3(OUT) U104.8(VCC)
+3V3_A: C105.2 R101.2 U101.43(ADC_AVDD)
+5V_USB: C111.2 C118.2 C119.2 D101.2 D102.2 J101.2(VBUS) J101.11(VBUS) U102.1(IN)
GND: C101.1 C102.1 C103.1 C104.1 C105.1 C106.1 C107.1 C108.1 C109.1 C111.1 C112.1 C113.1 C114.1 C115.1 C116.1 C118.1 C119.1 C123.2 C124.2 C126.1 C127.1 C201.1 C203.1 C204.1 D101.1 D102.1 D103.1 D104.1 ENC201.3 ENC201.4 ENC201.C FPC1.8 FPC1.10 J101.1(GND) J101.12(GND) J101.13(SHELL) J101.14(SHELL) J102.2 LED102.2(K) MH201.1 MH202.1 MH203.1 MH204.1 MH205.1 MH206.1 MH207.1 MH208.1 R118.1 R119.1 SW101.1(A) SW101.2(B) SW102.1(A) SW102.2(B) U101.19(TESTEN) U101.57(GND) U102.2(GND) U102.4(GND) U104.4(GND) Y101.2(GND) Y101.4(GND)
COL0: J201.1 J204.1 J207.1 J240.1 J243.1 J246.1 R108.2
COL0_R: R108.1 U101.2(GPIO0)
COL1: J202.1 J205.1 J208.1 J241.1 J244.1 J247.1 R110.2
COL1_R: R110.1 U101.3(GPIO1)
COL2: J203.1 J206.1 J209.1 J242.1 J245.1 J248.1 R112.2
COL2_R: R112.1 U101.4(GPIO2)
COL3: J210.1 J213.1 J216.1 J249.1 J252.1 J255.1 R113.2
COL3_R: R113.1 U101.5(GPIO3)
COL4: J211.1 J214.1 J217.1 J250.1 J253.1 J256.1 R208.2
COL4_R: R208.1 U101.6(GPIO4)
COL5: J212.1 J215.1 J218.1 J251.1 J254.1 J257.1 R209.2
COL5_R: R209.1 U101.7(GPIO5)
COL6: J219.1 J222.1 J225.1 J258.1 J261.1 J264.1 R210.2
COL6_R: R210.1 U101.8(GPIO6)
COL7: J220.1 J223.1 J226.1 J259.1 J262.1 J265.1 R211.2
COL7_R: R211.1 U101.9(GPIO7)
COL8: J221.1 J224.1 J227.1 J260.1 J263.1 J266.1 R212.2
COL8_R: R212.1 U101.11(GPIO8)
COL9: J228.1 J231.1 J234.1 J267.1 J270.1 J273.1 R213.2
COL9_R: R213.1 U101.12(GPIO9)
COL10: J229.1 J232.1 J235.1 J268.1 J271.1 J274.1 R214.2
COL10_R: R214.1 U101.13(GPIO10)
COL11: J230.1 J233.1 J236.1 J269.1 J272.1 J275.1 R215.2
COL11_R: R215.1 U101.14(GPIO11)
COL12: J237.1 J238.1 J239.1 J276.1 J277.1 J278.1 R216.2
COL12_R: R216.1 U101.15(GPIO12)
CON_USB_N: D103.2 J101.5(DN2) J101.7(DN1) R109.1
CON_USB_P: D104.2 J101.6(DP1) J101.8(DP2) R111.1
CS: FPC1.5 U101.32(GPIO21)
ENC1_A: C203.2 R205.1 U101.30(GPIO19)
ENC1_B: C204.2 R207.1 U101.31(GPIO20)
QSPI_SCLK: U101.52(QSPI_SCLK) U104.6(CLK)
QSPI_SD0: U101.53(QSPI_SD0) U104.5(DI)
QSPI_SD1: U101.55(QSPI_SD1) U104.2(DO)
QSPI_SD2: U101.54(QSPI_SD2) U104.3(IO2)
QSPI_SD3: U101.51(QSPI_SD3) U104.7(IO3)
QSPI_SS: R124.2 U101.56(QSPI_SS) U104.1(CS#)
RESET_N: C127.2 R125.2 U101.26(RUN)
ROW0: D201.1(K) D202.1(K) D203.1(K) D213.1(K) D214.1(K) D215.1(K) D225.1(K) D226.1(K) D227.1(K) D237.1(K) D238.1(K) D239.1(K) D249.1(K) R217.2
ROW0_R: R217.1 U101.16(GPIO13)
ROW1: D204.1(K) D205.1(K) D206.1(K) D216.1(K) D217.1(K) D218.1(K) D228.1(K) D229.1(K) D230.1(K) D240.1(K) D241.1(K) D242.1(K) D250.1(K) R218.2
ROW1_R: R218.1 U101.17(GPIO14)
ROW2: D207.1(K) D208.1(K) D209.1(K) D219.1(K) D220.1(K) D221.1(K) D231.1(K) D232.1(K) D233.1(K) D243.1(K) D244.1(K) D245.1(K) D251.1(K) R219.2
ROW2_R: R219.1 U101.18(GPIO15)
ROW3: D252.1(K) D253.1(K) D254.1(K) D261.1(K) D262.1(K) D263.1(K) D270.1(K) D271.1(K) D272.1(K) D279.1(K) D280.1(K) D281.1(K) D288.1(K) R220.2
ROW3_R: R220.1 U101.27(GPIO16)
ROW4: D255.1(K) D256.1(K) D257.1(K) D264.1(K) D265.1(K) D266.1(K) D273.1(K) D274.1(K) D275.1(K) D282.1(K) D283.1(K) D284.1(K) D289.1(K) R221.2
ROW4_R: R221.1 U101.28(GPIO17)
ROW5: D258.1(K) D259.1(K) D260.1(K) D267.1(K) D268.1(K) D269.1(K) D276.1(K) D277.1(K) D278.1(K) D285.1(K) D286.1(K) D287.1(K) D290.1(K) R222.2
ROW5_R: R222.1 U101.29(GPIO18)
RS: FPC1.3 U101.34(GPIO22)
RSTB: FPC1.4 U101.40(GPIO28_ADC2)
SCL: FPC1.2 U101.39(GPIO27_ADC1)
SDA: FPC1.1 U101.38(GPIO26_ADC0)
SWCLK: J102.1 U101.24(SWCLK)
SWDIO: J102.3 U101.25(SWD)
TE: FPC1.6 U101.41(GPIO29_ADC3)
USB_N: R109.2 U101.46(USB_DM)
USB_P: R111.2 U101.47(USB_DP)
X_R: C124.1 R121.1 Y101.3
XIN: C123.1 R120.2 U101.20(XIN) Y101.1
XOUT: R120.1 R121.2 U101.21(XOUT)
$1N6734: J101.10(CC2) R118.2
$1N6739: J101.4(CC1) R119.2
$1N8227: R122.1 R124.1 SW101.3(C) SW101.4(D)
$1N8669: R123.1 R125.1 SW102.3(C) SW102.4(D)
$1N9334: LED102.1(A) R104.1
$2N527: D201.2(A) J201.2
$2N632: D202.2(A) J202.2
$2N737: D203.2(A) J203.2
$2N1048: D204.2(A) J204.2
$2N1050: D205.2(A) J205.2
$2N1052: D206.2(A) J206.2
$2N1363: D207.2(A) J207.2
$2N1365: D208.2(A) J208.2
$2N1367: D209.2(A) J209.2
$2N1909: ENC201.A R201.1 R205.2
$2N1913: ENC201.B R202.1 R207.2
$2N15412: D213.2(A) J210.2
$2N15413: D214.2(A) J211.2
$2N15414: D215.2(A) J212.2
$2N15415: D216.2(A) J213.2
$2N15416: D217.2(A) J214.2
$2N15417: D218.2(A) J215.2
$2N15418: D219.2(A) J216.2
$2N15419: D220.2(A) J217.2
$2N15420: D221.2(A) J218.2
$2N16542: D225.2(A) J219.2
$2N16543: D226.2(A) J220.2
$2N16544: D227.2(A) J221.2
$2N16545: D228.2(A) J222.2
$2N16546: D229.2(A) J223.2
$2N16547: D230.2(A) J224.2
$2N16548: D231.2(A) J225.2
$2N16549: D232.2(A) J226.2
$2N16550: D233.2(A) J227.2
$2N17623: D237.2(A) J228.2
$2N17624: D238.2(A) J229.2
$2N17625: D239.2(A) J230.2
$2N17626: D240.2(A) J231.2
$2N17627: D241.2(A) J232.2
$2N17628: D242.2(A) J233.2
$2N17629: D243.2(A) J234.2
$2N17630: D244.2(A) J235.2
$2N17631: D245.2(A) J236.2
$2N18173: D249.2(A) J237.2
$2N18174: D250.2(A) J238.2
$2N18175: D251.2(A) J239.2
$2N30184: D252.2(A) J240.2
$2N30185: D253.2(A) J241.2
$2N30186: D254.2(A) J242.2
$2N30187: D255.2(A) J243.2
$2N30188: D256.2(A) J244.2
$2N30189: D257.2(A) J245.2
$2N30190: D258.2(A) J246.2
$2N30191: D259.2(A) J247.2
$2N30192: D260.2(A) J248.2
$2N30202: D261.2(A) J249.2
$2N30203: D262.2(A) J250.2
$2N30204: D263.2(A) J251.2
$2N30205: D264.2(A) J252.2
$2N30206: D265.2(A) J253.2
$2N30207: D266.2(A) J254.2
$2N30208: D267.2(A) J255.2
$2N30209: D268.2(A) J256.2
$2N30210: D269.2(A) J257.2
$2N30217: D270.2(A) J258.2
$2N30218: D271.2(A) J259.2
$2N30219: D272.2(A) J260.2
$2N30220: D273.2(A) J261.2
$2N30221: D274.2(A) J262.2
$2N30222: D275.2(A) J263.2
$2N30223: D276.2(A) J264.2
$2N30224: D277.2(A) J265.2
$2N30225: D278.2(A) J266.2
$2N30232: D279.2(A) J267.2
$2N30233: D280.2(A) J268.2
$2N30234: D281.2(A) J269.2
$2N30235: D282.2(A) J270.2
$2N30236: D283.2(A) J271.2
$2N30237: D284.2(A) J272.2
$2N30238: D285.2(A) J273.2
$2N30239: D286.2(A) J274.2
$2N30240: D287.2(A) J275.2
$2N30247: D288.2(A) J276.2
$2N30248: D289.2(A) J277.2
$2N30249: D290.2(A) J278.2
$2N37016: FPC1.9 R224.1
$2N37088: FPC1.7 R223.1

Not connected (* = marked no-connect by the designer): ENC201 1* 2*; FPC1 11* 12*; J101 3(SBU2)* 9(SBU1)*; U101 35(GPIO23)* 36(GPIO24)* 37(GPIO25)*

## Notes on the sheets
sheet 1
- Custom Keyboard (Page 1/2)
- 5V to 3V3
- MCU
- Power LED
- USB Connector
- NF
- Debug Header
- BOOT Select Button
- Reset Button
- FLASH
- NF
- NF
sheet 2
- Custom Keyboard (Page 2/2)
- KEYS
- ENCODER 1
- Watch the full step-by step tutorial about how to
  design this board on my youtube channel:
  https://www.youtube.com/robertferanec
  Download all the mechanical parts from my thingiverse:
  https://www.thingiverse.com/robertferanec/designs
- NOTES:
  What else you need to build this keyboard
  Buy:
  - 9x Keycaps e.g. Mouser 474-PRT-15305
  - 4x Feet, Farnell 2494552
  - 2x M3x10 self-tapping screw
  - 2x M3x12 self-tapping screw
  - 4x M2.5x8 black machine screw
  - Gorilla Super Glue Gel, Farnell 3532524
  3D printed parts (color #1):
  - 1x box bottom
  - 1x box top
  - 1x plate (CNC or 3D printed)
  - 3x encoder knob
  3D printed parts (color #2):
  - 1x frame around buttons
  - 3x frame around encoders
  - 3x encoder knob top
  3D transparent filament:
  - 3x short pieces as a LED light guide
  Optional:
  - Use color 3D printing with custom picture
  - Tools to remove caps and switches
- Custom Keyboard © 2025 by FEDEVEL
  is licensed under Creative Commons
  Attribution-NonCommercial-ShareAlike 4.0 International
  https://creativecommons.org/licenses/by-nc-sa/4.0/
- Metal plate holders
- Mounting holes
